# Altium schematic sheet Sheet1.SchDoc
size A; SheetNumber: 1; SheetTotal: 1
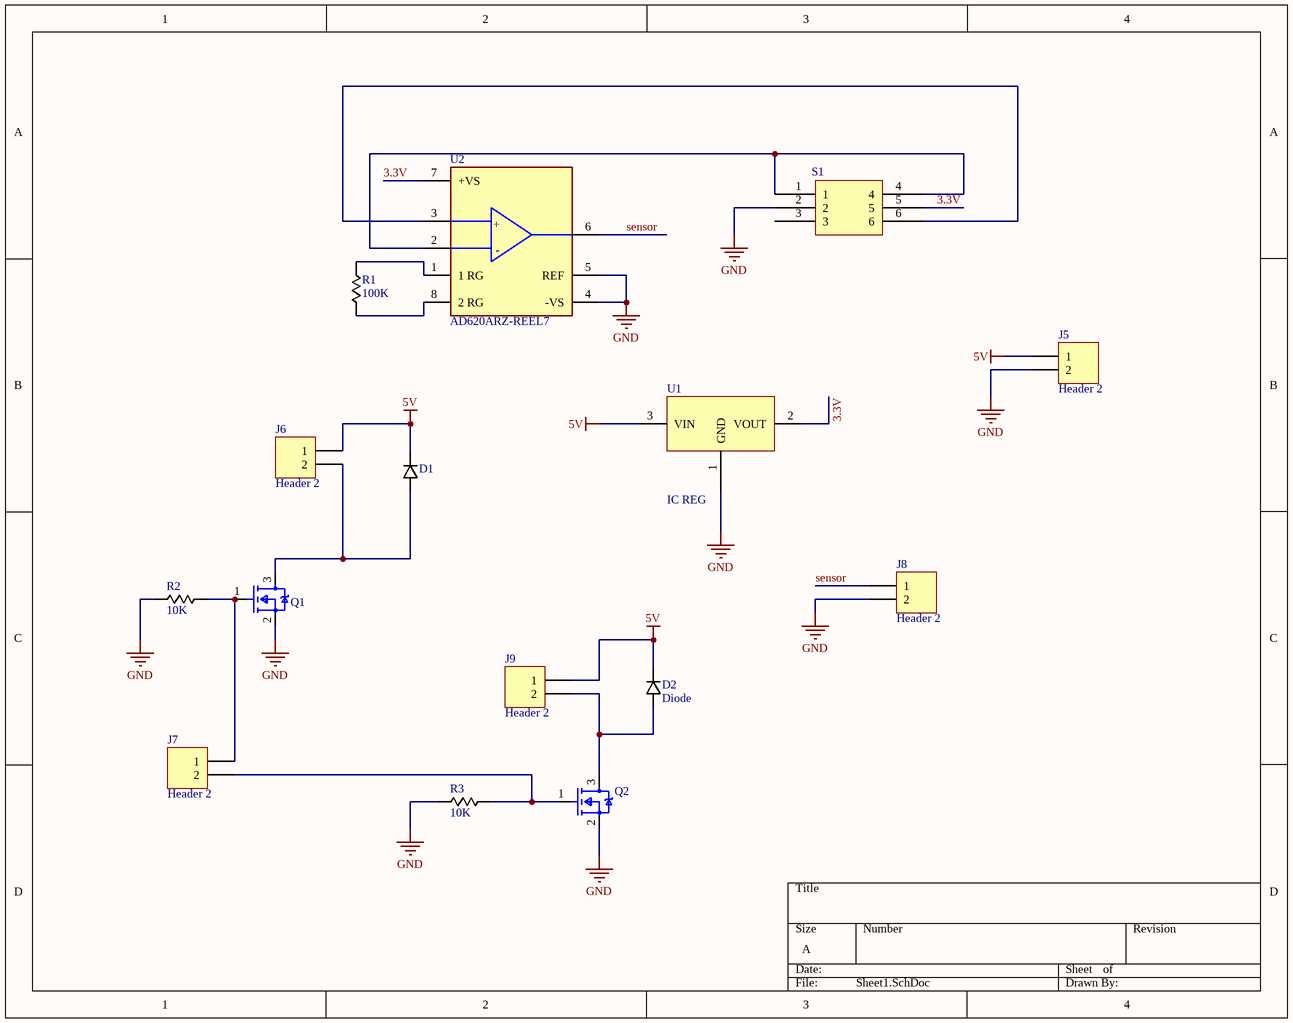
[diagram p0: Sheet1.SchDoc]

## Parts
D1  Diode  [DIODE SMA]  (value not drawn)
D2  Diode  [DIODE SMA]
J5  Header 2  [HDR1X2]
J6  Header 2  [HDR1X2]
J7  Header 2  [HDR1X2]
J8  Header 2  [HDR1X2]
J9  Header 2  [HDR1X2]
Q1  IRLZ44NPbF  [SOT23]  (value not drawn)
Q2  IRLZ44NPbF  [SOT23]  (value not drawn)
R1  100K  [0402]
R2  10K  [0402]
R3  10K  [0402]
S1  IC 6 PINS  [Pressure_sensor]  (value not drawn)
U1  IC REG  [SOT23]
U2  AD620ARZ-REEL7  [FP-R-8-IPC_B]

## Nets
5V: D1.2(K) D2.2(K) J5.1 J6.1 J9.1 U1.3(VIN)
GND: J5.2 J8.2 Q1.2(S) Q2.2(S) R2.1 R3.1 S1.2 U1.1(GND) U2.4(-VS) U2.5(REF)
3.3V: S1.5 U1.2(VOUT) U2.7(+VS)
sensor: J8.1 U2.6(OUTPUT)
NetD1_1: D1.1(A) J6.2 Q1.3(D)
NetD2_1: D2.1(A) J9.2 Q2.3(D)
NetJ7_1: J7.1 Q1.1(G) R2.2
NetJ7_2: J7.2 Q2.1(G) R3.2
NetR1_1: R1.1 U2.8(2_RG)
NetR1_2: R1.2 U2.1(1_RG)
NetS1_1: S1.1 S1.4 U2.2(-IN)
NetS1_6: S1.6 U2.3(+IN)

Not connected (* = marked no-connect by the designer): S1 3

## Notes on the sheet
- (in symbol CMP-09116-000354-1) +

## Library data of the parts
J5-J9 = Header 2: Header, 2-Pin; LatestRevisionDate: 17-Jul-2002; LatestRevisionNote: Re-released for DXP Platform.; Publisher: Altium Limited
Q1 Q2 = MOSFET N: MOSFET N-CH 55V 47A TO220AB
R1-R3 = RESISTOR
U2 = CMP-09116-000354-1: IC INST AMP 1 CIRCUIT 8SOIC; Input Resistance: 10GR; Bandwidth: 800kHz; Dual Supply Voltage: 15V; Number of Channels: 1; Power Dissipation: 650mW; Input Bias Current: 500pA; Common Mode Rejection Ratio: 93dB; Slew Rate: 1.2V/µs; Supply Current: 900uA; Input Offset Voltage (Vos): 30mV; Min Dual Supply Voltage: 2.3V; Min Supply Voltage: 4.6V; Power Supply Rejection Ratio (PSRR): 140dB; Operating Supply Voltage: 18V; Output Current per Channel: 18mA; -3db Bandwidth: 1MHz; Operating Supply Current: 1.3mA; Mount: Surface Mount; RoHS Compliant: Yes; Max Operating Temperature: 125°C; Radiation Hardening: No; Packaging: Tape and Reel; Nominal Supply Current: 900uA; Contact Plating: Tin; Number of Elements: 1; Number of Circuits: 1; Series: -; Case/Package: SOIC; Package Quantity: 1; Max Dual Supply Voltage: 18V; Min Operating Temperature: -55°C; Lead Free: Contains Lead; Number of Pins: 8; Max Power Dissipation: 650mW